# EAGLE schematic Lab4 schematic (EAGLE 6.3)
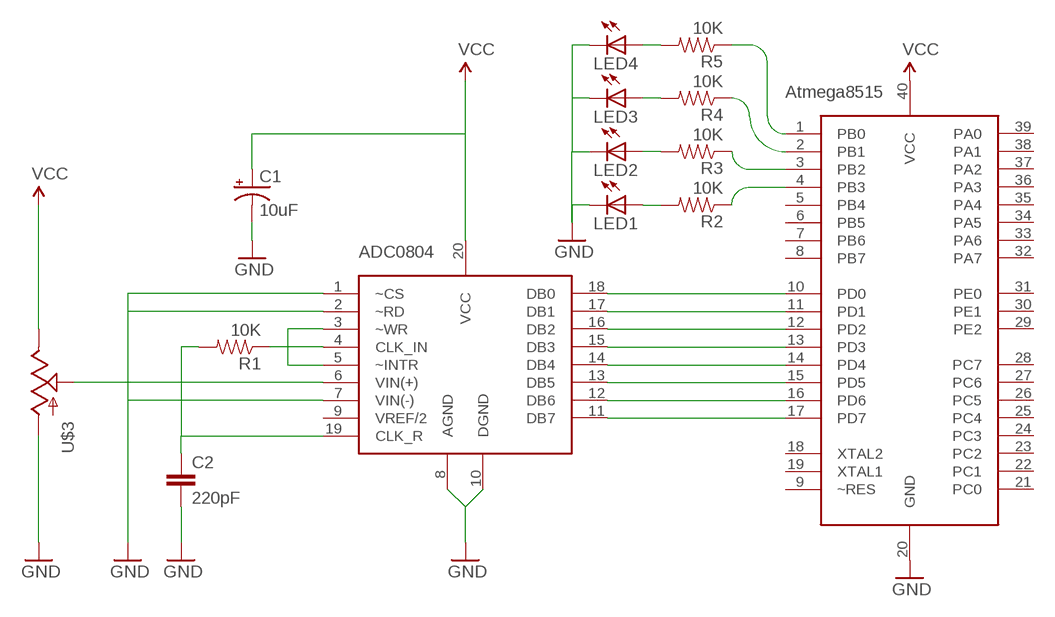
[diagram p0: schematic, sheet 1]

## Parts
C1  10uF  CAP_POL1206  [EIA3216]
C2  220pF  CAPPTH  [CAP-PTH-SMALL]
LED1  LED3MM  [LED3MM]
LED2  LED3MM  [LED3MM]
LED3  LED3MM  [LED3MM]
LED4  LED3MM  [LED3MM]
R1  10K  RESISTORPTH1  [AXIAL-0.3]
R2  10K  RESISTORPTH1  [AXIAL-0.3]
R3  10K  RESISTORPTH1  [AXIAL-0.3]
R4  10K  RESISTORPTH1  [AXIAL-0.3]
R5  10K  RESISTORPTH1  [AXIAL-0.3]
U$1  ATMEGA8515  [DIL-40]
U$2  ADC0804  [DIL20]
U$3  POT  [ALPS_POT]

## Nets
GND: C1.C(-) C2.2 LED1.K(C) LED2.K(C) LED3.K(C) LED4.K(C) U$1.20(GND) U$2.1(~CS) U$2.2(~RD) U$2.7(VIN(-)) U$2.8(AGND) U$2.10(DGND) U$3.P$3(A)
N$1: U$2.6(VIN(+)) U$3.P$2(S)
N$2: U$2.3(~WR) U$2.5(~INTR)
N$3: R1.P$1 U$2.4(CLK_IN)
N$4: C2.1 R1.P$2 U$2.19(CLK_R)
N$5: U$1.10(PD0) U$2.18(DB0)
N$6: U$1.11(PD1) U$2.17(DB1)
N$7: U$1.12(PD2) U$2.16(DB2)
N$8: U$1.13(PD3) U$2.15(DB3)
N$9: U$1.14(PD4) U$2.14(DB4)
N$10: U$1.15(PD5) U$2.13(DB5)
N$11: U$1.16(PD6) U$2.12(DB6)
N$12: U$1.17(PD7) U$2.11(DB7)
N$13: LED4.A R5.P$2
N$14: LED3.A R4.P$2
N$15: LED2.A R3.P$2
N$16: LED1.A R2.P$2
N$17: R2.P$1 U$1.4(PB3)
N$18: R3.P$1 U$1.3(PB2)
N$19: R4.P$1 U$1.2(PB1)
N$20: R5.P$1 U$1.1(PB0)
VCC: C1.A(+) U$1.40(VCC) U$2.20(VCC) U$3.P$1(E)
Unconnected: U$1.5(PB4) U$1.6(PB5) U$1.7(PB6) U$1.8(PB7) U$1.9(~RES) U$1.18(XTAL2) U$1.19(XTAL1) U$1.21(PC0) U$1.22(PC1) U$1.23(PC2) U$1.24(PC3) U$1.25(PC4) U$1.26(PC5) U$1.27(PC6) U$1.28(PC7) U$1.29(PE2) U$1.30(PE1) U$1.31(PE0) U$1.32(PA7) U$1.33(PA6) U$1.34(PA5) U$1.35(PA4) U$1.36(PA3) U$1.37(PA2) U$1.38(PA1) U$1.39(PA0) U$2.9(VREF/2)

## Library data of the parts
C1 = 1x05smd:CAP_POL: Capacitor Polarized These are standard SMD and PTH capacitors. Normally 10uF, 47uF, and 100uF in electrolytic and tantalum varieties. Always verify the external diameter of the through hole cap, it varies with capacity, voltage, and manufacturer. The EIA devices should be standard.
C2 = 1x05smd:CAP: Capacitor Standard 0603 ceramic capacitor, and 0.1" leaded capacitor.
LED1-LED4 = adafruit:LED: LED OSRAM: - CHIPLED LG R971, LG N971, LY N971, LG Q971, LY Q971, LO R971, LY R971 LH N974, LH R974 LS Q976, LO Q976, LY Q976 LO Q996 - Hyper CHIPLED LW Q18S LB Q993, LB Q99A, LB R99A - SideLED LS A670, LO A670, LY A670, LG A670, LP A670 LB A673, LV A673, LT A673, LW A673 LH A674 LY A675 LS A676, LA A676, LO A676, LY A676, LW A676 LS A679, LY A679, LG A679 - Hyper Micro SIDELED® LS Y876, LA Y876, LO Y876, LY Y876 LT Y87S - SmartLED LW L88C, LW L88S LB L89C, LB L89S, LG L890 LS L89K, LO L89K, LY L89K LS L896, LA L896, LO L896, LY L896 - TOPLED LS T670, LO T670, LY T670, LG T670, LP T670 LSG T670, LSP T670, LSY T670, LOP T670, LYG T670 LG T671, LOG T671, LSG T671 LB T673, LV T673, LT T673, LW T673 LH T674 LS T676, LA T676, LO T676, LY T676, LB T676, LH T676, LSB T676, LW T676 LB T67C, LV T67C, LT T67C, LS T67K, LO T67K, LY T67K, LW E67C LS E67B, LA E67B, LO E67B, LY E67B, LB E67C, LV E67C, LT E67C LW T67C LS T679, LY T679, LG T679 LS T770, LO T770, LY T770, LG T770, LP T770 LB T773, LV T773, LT T773, LW T773 LH T774 LS E675, LA E675, LY E675, LS T675 LS T776, LA T776, LO T776, LY T776, LB T776 LHGB T686 LT T68C, LB T68C - Hyper Mini TOPLED® LB M676 - Mini TOPLED Santana® LG M470 LS M47K, LO M47K, LY M47K Source: http://www.osram.convergy.de/
R1-R5 = 1x05smd:RESISTOR: Resistor Basic schematic elements and footprints for 0603, 1206, and PTH 1/10th watt (small) resistors.
U$1 = Shannon:ATMEGA8515
U$2 = Shannon:ADC0804
U$3 = 1x05smd:POT